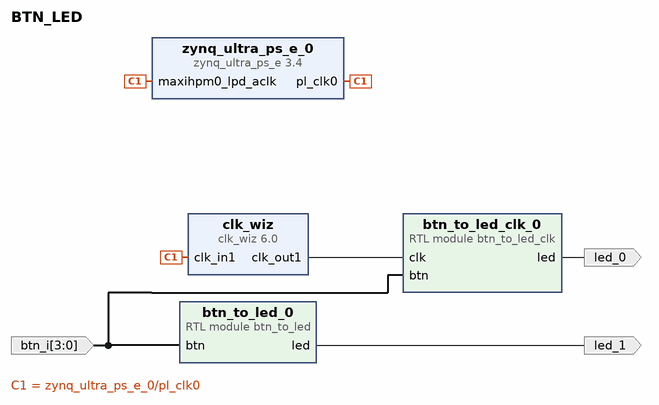
[diagram p0: block diagram of the top level]
# Vivado block design BTN_LED, xck26-sfvc784-2LV-c, Vivado 2022.1
create_bd_design BTN_LED

create_bd_port -dir O led_0
create_bd_port -dir O led_1
create_bd_port -dir I -from 3 -to 0 btn_i

create_bd_cell -type module -reference btn_to_led btn_to_led_0
create_bd_cell -type module -reference btn_to_led_clk btn_to_led_clk_0
create_bd_cell -type ip -vlnv xilinx.com:ip:clk_wiz:6.0 clk_wiz
create_bd_cell -type ip -vlnv xilinx.com:ip:zynq_ultra_ps_e:3.4 zynq_ultra_ps_e_0
set_property -dict [list \
  CONFIG.PSU__CRL_APB__PL0_REF_CTRL__SRCSEL RPLL \
  CONFIG.PSU__DDR_HIGH_ADDRESS_GUI_ENABLE 0 \
  CONFIG.PSU__OVERRIDE__BASIC_CLOCK 0 \
] [get_bd_cells zynq_ultra_ps_e_0]
# 26 more settings of zynq_ultra_ps_e_0 are not shown: defaults, MIO pin electricals, DDR timing, and values the tool derives

# ---- connections ----

connect_bd_net [get_bd_ports btn_i] [get_bd_pins btn_to_led_0/btn] [get_bd_pins btn_to_led_clk_0/btn]
connect_bd_net [get_bd_pins clk_wiz/clk_out1] [get_bd_pins btn_to_led_clk_0/clk]
connect_bd_net -net led_0 [get_bd_pins btn_to_led_clk_0/led] [get_bd_ports led_0]
connect_bd_net -net led_1 [get_bd_pins btn_to_led_0/led] [get_bd_ports led_1]
connect_bd_net [get_bd_pins zynq_ultra_ps_e_0/pl_clk0] [get_bd_pins clk_wiz/clk_in1] [get_bd_pins zynq_ultra_ps_e_0/maxihpm0_lpd_aclk]

validate_bd_design
save_bd_design
